# Altium project Sophia_Lake.PrjPcb (part 3 of 4)

## Sheet DDR.SchDoc
size C; DocumentNumber: 5; SheetNumber: 5; SheetTotal: 8
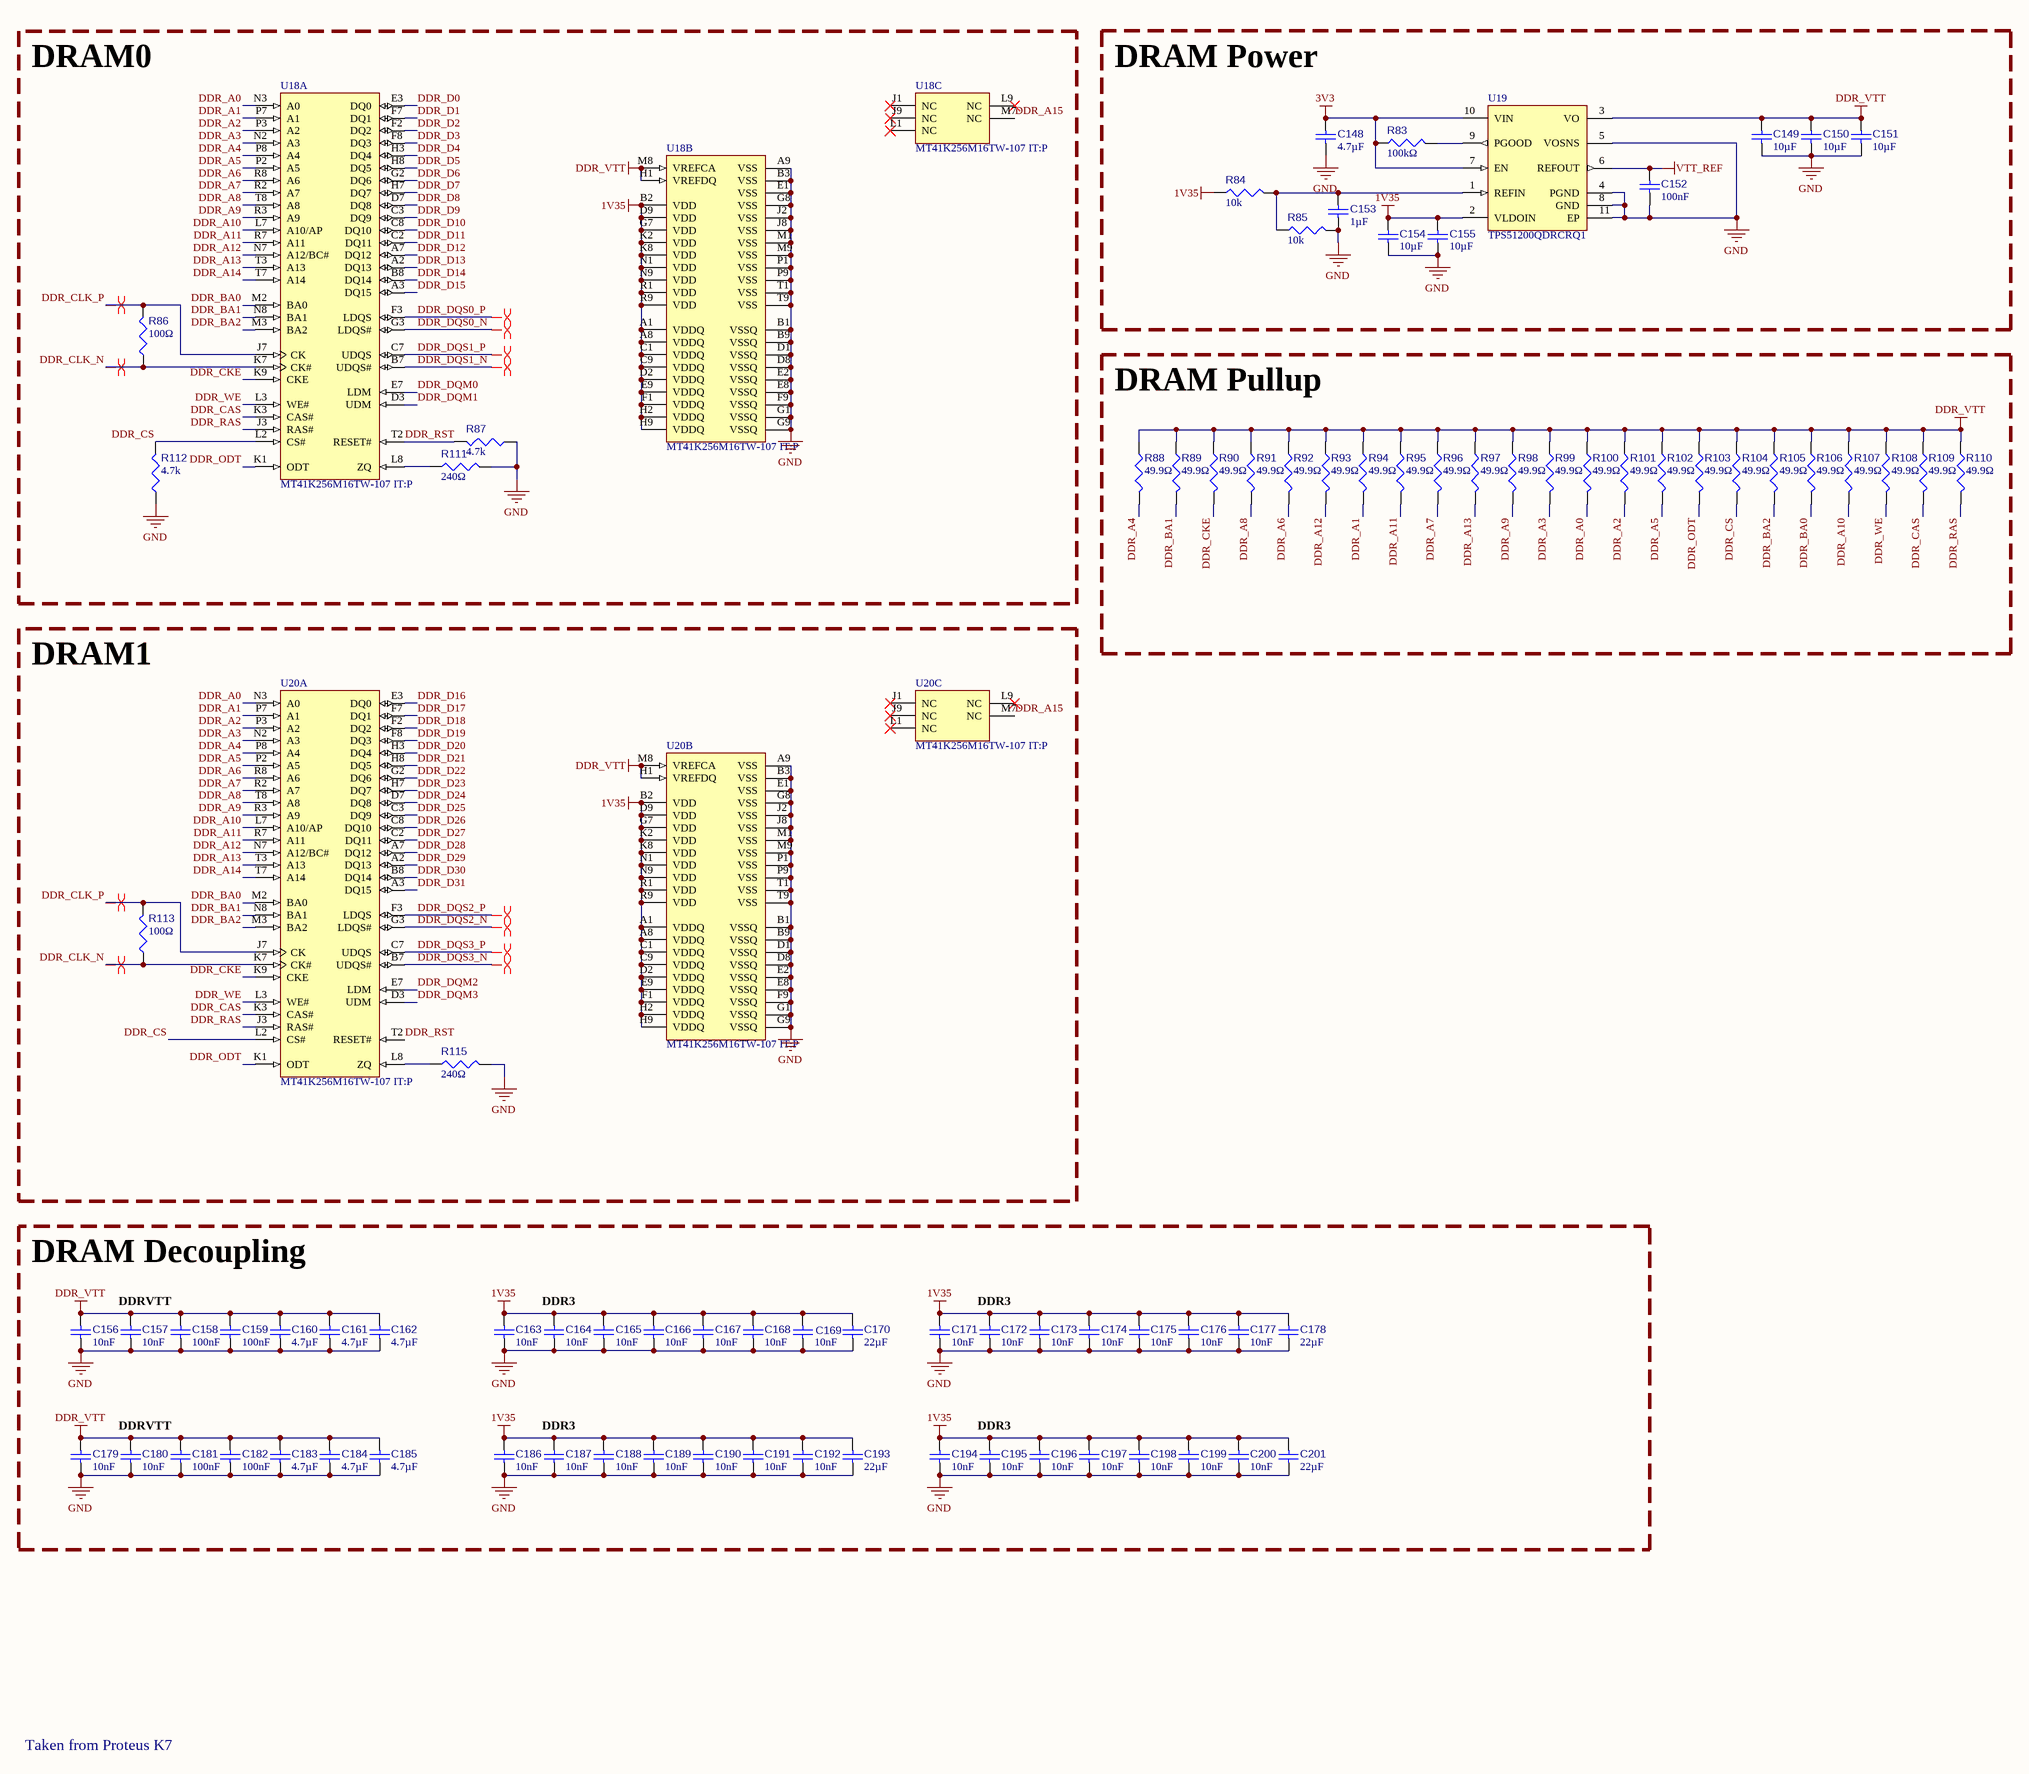
[diagram p8: DDR.SchDoc]

### Parts
C148  value 4.7µF  [CAP-0402-MFG]  (hidden comment: GRM155R61E475ME15D)
C149  value 10µF  [CAP-0603-MFG]  (hidden comment: GRT188R61C106KE13J)
C150  value 10µF  [CAP-0603-MFG]  (hidden comment: GRT188R61C106KE13J)
C151  value 10µF  [CAP-0603-MFG]  (hidden comment: GRT188R61C106KE13J)
C152  value 100nF  [CAP-0402-MFG]  (hidden comment: CL05B104KO5VPNC)
C153  value 1µF  [CAP-0402-MFG]  (hidden comment: GRT155C81C105KE13J)
C154  value 10µF  [CAP-0603-MFG]  (hidden comment: GRT188R61C106KE13J)
C155  value 10µF  [CAP-0603-MFG]  (hidden comment: GRT188R61C106KE13J)
C156  value 10nF  [CAP-0402-MFG]  (hidden comment: AC0402KRX7R7BB103)
C157  value 10nF  [CAP-0402-MFG]  (hidden comment: AC0402KRX7R7BB103)
C158  value 100nF  [CAP-0402-MFG]  (hidden comment: CL05B104KO5VPNC)
C159  value 100nF  [CAP-0402-MFG]  (hidden comment: CL05B104KO5VPNC)
C160  value 4.7µF  [CAP-0402-MFG]  (hidden comment: GRM155R61E475ME15D)
C161  value 4.7µF  [CAP-0402-MFG]  (hidden comment: GRM155R61E475ME15D)
C162  value 4.7µF  [CAP-0402-MFG]  (hidden comment: GRM155R61E475ME15D)
C163  value 10nF  [CAP-0402-MFG]  (hidden comment: AC0402KRX7R7BB103)
C164  value 10nF  [CAP-0402-MFG]  (hidden comment: AC0402KRX7R7BB103)
C165  value 10nF  [CAP-0402-MFG]  (hidden comment: AC0402KRX7R7BB103)
C166  value 10nF  [CAP-0402-MFG]  (hidden comment: AC0402KRX7R7BB103)
C167  value 10nF  [CAP-0402-MFG]  (hidden comment: AC0402KRX7R7BB103)
C168  value 10nF  [CAP-0402-MFG]  (hidden comment: AC0402KRX7R7BB103)
C169  value 10nF  [CAP-0402-MFG]  (hidden comment: AC0402KRX7R7BB103)
C170  value 22µF  [CAP-0402-MFG]  (hidden comment: GRM158R61A226ME15D)
C171  value 10nF  [CAP-0402-MFG]  (hidden comment: AC0402KRX7R7BB103)
C172  value 10nF  [CAP-0402-MFG]  (hidden comment: AC0402KRX7R7BB103)
C173  value 10nF  [CAP-0402-MFG]  (hidden comment: AC0402KRX7R7BB103)
C174  value 10nF  [CAP-0402-MFG]  (hidden comment: AC0402KRX7R7BB103)
C175  value 10nF  [CAP-0402-MFG]  (hidden comment: AC0402KRX7R7BB103)
C176  value 10nF  [CAP-0402-MFG]  (hidden comment: AC0402KRX7R7BB103)
C177  value 10nF  [CAP-0402-MFG]  (hidden comment: AC0402KRX7R7BB103)
C178  value 22µF  [CAP-0402-MFG]  (hidden comment: GRM158R61A226ME15D)
C179  value 10nF  [CAP-0402-MFG]  (hidden comment: AC0402KRX7R7BB103)
C180  value 10nF  [CAP-0402-MFG]  (hidden comment: AC0402KRX7R7BB103)
C181  value 100nF  [CAP-0402-MFG]  (hidden comment: CL05B104KO5VPNC)
C182  value 100nF  [CAP-0402-MFG]  (hidden comment: CL05B104KO5VPNC)
C183  value 4.7µF  [CAP-0402-MFG]  (hidden comment: GRM155R61E475ME15D)
C184  value 4.7µF  [CAP-0402-MFG]  (hidden comment: GRM155R61E475ME15D)
C185  value 4.7µF  [CAP-0402-MFG]  (hidden comment: GRM155R61E475ME15D)
C186  value 10nF  [CAP-0402-MFG]  (hidden comment: AC0402KRX7R7BB103)
C187  value 10nF  [CAP-0402-MFG]  (hidden comment: AC0402KRX7R7BB103)
C188  value 10nF  [CAP-0402-MFG]  (hidden comment: AC0402KRX7R7BB103)
C189  value 10nF  [CAP-0402-MFG]  (hidden comment: AC0402KRX7R7BB103)
C190  value 10nF  [CAP-0402-MFG]  (hidden comment: AC0402KRX7R7BB103)
C191  value 10nF  [CAP-0402-MFG]  (hidden comment: AC0402KRX7R7BB103)
C192  value 10nF  [CAP-0402-MFG]  (hidden comment: AC0402KRX7R7BB103)
C193  value 22µF  [CAP-0402-MFG]  (hidden comment: GRM158R61A226ME15D)
C194  value 10nF  [CAP-0402-MFG]  (hidden comment: AC0402KRX7R7BB103)
C195  value 10nF  [CAP-0402-MFG]  (hidden comment: AC0402KRX7R7BB103)
C196  value 10nF  [CAP-0402-MFG]  (hidden comment: AC0402KRX7R7BB103)
C197  value 10nF  [CAP-0402-MFG]  (hidden comment: AC0402KRX7R7BB103)
C198  value 10nF  [CAP-0402-MFG]  (hidden comment: AC0402KRX7R7BB103)
C199  value 10nF  [CAP-0402-MFG]  (hidden comment: AC0402KRX7R7BB103)
C200  value 10nF  [CAP-0402-MFG]  (hidden comment: AC0402KRX7R7BB103)
C201  value 22µF  [CAP-0402-MFG]  (hidden comment: GRM158R61A226ME15D)
R83  value 100kΩ  [RES-0402]  (hidden comment: AC0402FR-07100KL)
R84  value 10k  [RES-0402]  (hidden comment: AC0402FR-0710KL)
R85  value 10k  [RES-0402]  (hidden comment: AC0402FR-0710KL)
R86  value 100Ω  [RES-0402]  (hidden comment: AC0402FR-07100RL)
R87  value 4.7k  [RES-0402]  (hidden comment: AC0402FR-074K7L)
R88  value 49.9Ω  [RES-0402]  (hidden comment: CRCW040249R9FKED)
R89  value 49.9Ω  [RES-0402]  (hidden comment: CRCW040249R9FKED)
R90  value 49.9Ω  [RES-0402]  (hidden comment: CRCW040249R9FKED)
R91  value 49.9Ω  [RES-0402]  (hidden comment: CRCW040249R9FKED)
R92  value 49.9Ω  [RES-0402]  (hidden comment: CRCW040249R9FKED)
R93  value 49.9Ω  [RES-0402]  (hidden comment: CRCW040249R9FKED)
R94  value 49.9Ω  [RES-0402]  (hidden comment: CRCW040249R9FKED)
R95  value 49.9Ω  [RES-0402]  (hidden comment: CRCW040249R9FKED)
R96  value 49.9Ω  [RES-0402]  (hidden comment: CRCW040249R9FKED)
R97  value 49.9Ω  [RES-0402]  (hidden comment: CRCW040249R9FKED)
R98  value 49.9Ω  [RES-0402]  (hidden comment: CRCW040249R9FKED)
R99  value 49.9Ω  [RES-0402]  (hidden comment: CRCW040249R9FKED)
R100  value 49.9Ω  [RES-0402]  (hidden comment: CRCW040249R9FKED)
R101  value 49.9Ω  [RES-0402]  (hidden comment: CRCW040249R9FKED)
R102  value 49.9Ω  [RES-0402]  (hidden comment: CRCW040249R9FKED)
R103  value 49.9Ω  [RES-0402]  (hidden comment: CRCW040249R9FKED)
R104  value 49.9Ω  [RES-0402]  (hidden comment: CRCW040249R9FKED)
R105  value 49.9Ω  [RES-0402]  (hidden comment: CRCW040249R9FKED)
R106  value 49.9Ω  [RES-0402]  (hidden comment: CRCW040249R9FKED)
R107  value 49.9Ω  [RES-0402]  (hidden comment: CRCW040249R9FKED)
R108  value 49.9Ω  [RES-0402]  (hidden comment: CRCW040249R9FKED)
R109  value 49.9Ω  [RES-0402]  (hidden comment: CRCW040249R9FKED)
R110  value 49.9Ω  [RES-0402]  (hidden comment: CRCW040249R9FKED)
R111  value 240Ω  [RES-0402]  (hidden comment: AC0402FR-07240RL)
R112  value 4.7k  [RES-0402]  (hidden comment: AC0402FR-074K7L)
R113  value 100Ω  [RES-0402]  (hidden comment: AC0402FR-07100RL)
R115  value 240Ω  [RES-0402]  (hidden comment: AC0402FR-07240RL)
U18  MT41K256M16TW-107 IT:P  [MICT-TW-96]  (parts A,B,C of 3)
U19  TPS51200QDRCRQ1  [FP-DRC0010J-MFG]
U20  MT41K256M16TW-107 IT:P  [MICT-TW-96]  (parts A,B,C of 3)

### Blocks framed on the sheet
DRAM0: R86 R87 R111 R112 U18
DRAM Power: C148-C155 R83-R85 U19
DRAM Pullup: R88-R110
DRAM1: R113 R115 U20
DRAM Decoupling: C156-C201

### Nets
1V35: C154.1 C155.1 C163.1 C164.1 C165.1 C166.1 C167.1 C168.2 C169.1 C170.1 C171.1 C172.2 C173.2 C174.2 C175.2 C176.2 C177.2 C178.1 C186.1 C187.2 C188.2 C189.2 C190.2 C191.2 C192.2 C193.1 C194.1 C195.2 C196.2 C197.2 C198.2 C199.2 C200.2 C201.1 R84.1 U18.A1(VDDQ) U18.A8(VDDQ) U18.B2(VDD) U18.C1(VDDQ) U18.C9(VDDQ) U18.D2(VDDQ) U18.D9(VDD) U18.E9(VDDQ) U18.F1(VDDQ) U18.G7(VDD) U18.H2(VDDQ) U18.H9(VDDQ) U18.K2(VDD) U18.K8(VDD) U18.N1(VDD) U18.N9(VDD) U18.R1(VDD) U18.R9(VDD) U19.2(VLDOIN) U20.A1(VDDQ) U20.A8(VDDQ) U20.B2(VDD) U20.C1(VDDQ) U20.C9(VDDQ) U20.D2(VDDQ) U20.D9(VDD) U20.E9(VDDQ) U20.F1(VDDQ) U20.G7(VDD) U20.H2(VDDQ) U20.H9(VDDQ) U20.K2(VDD) U20.K8(VDD) U20.N1(VDD) U20.N9(VDD) U20.R1(VDD) U20.R9(VDD)
3V3: C148.1 R83.1 U19.7(EN) U19.10(VIN)
DDR_VTT: C149.1 C150.1 C151.2 C156.1 C157.1 C158.2 C159.2 C160.1 C161.1 C162.2 C179.1 C180.1 C181.1 C182.1 C183.1 C184.1 C185.2 R88.1 R89.1 R90.1 R91.1 R92.1 R93.1 R94.1 R95.1 R96.1 R97.1 R98.1 R99.1 R100.1 R101.1 R102.1 R103.1 R104.1 R105.1 R106.1 R107.1 R108.1 R109.1 R110.1 U18.H1(VREFDQ) U18.M8(VREFCA) U19.3(VO) U20.H1(VREFDQ) U20.M8(VREFCA)
GND: C148.2 C149.2 C150.2 C151.1 C152.2 C153.1 C154.2 C155.2 C156.2 C157.2 C158.1 C159.1 C160.2 C161.2 C162.1 C163.2 C164.2 C165.2 C166.2 C167.2 C168.1 C169.2 C170.2 C171.2 C172.1 C173.1 C174.1 C175.1 C176.1 C177.1 C178.2 C179.2 C180.2 C181.2 C182.2 C183.2 C184.2 C185.1 C186.2 C187.1 C188.1 C189.1 C190.1 C191.1 C192.1 C193.2 C194.2 C195.1 C196.1 C197.1 C198.1 C199.1 C200.1 C201.2 R85.2 R87.1 R111.2 R112.1 R115.2 U18.A9(VSS) U18.B1(VSSQ) U18.B3(VSS) U18.B9(VSSQ) U18.D1(VSSQ) U18.D8(VSSQ) U18.E1(VSS) U18.E2(VSSQ) U18.E8(VSSQ) U18.F9(VSSQ) U18.G1(VSSQ) U18.G8(VSS) U18.G9(VSSQ) U18.J2(VSS) U18.J8(VSS) U18.M1(VSS) U18.M9(VSS) U18.P1(VSS) U18.P9(VSS) U18.T1(VSS) U18.T9(VSS) U19.4(PGND) U19.5(VOSNS) U19.8(GND) U19.11(EP) U20.A9(VSS) U20.B1(VSSQ) U20.B3(VSS) U20.B9(VSSQ) U20.D1(VSSQ) U20.D8(VSSQ) U20.E1(VSS) U20.E2(VSSQ) U20.E8(VSSQ) U20.F9(VSSQ) U20.G1(VSSQ) U20.G8(VSS) U20.G9(VSSQ) U20.J2(VSS) U20.J8(VSS) U20.M1(VSS) U20.M9(VSS) U20.P1(VSS) U20.P9(VSS) U20.T1(VSS) U20.T9(VSS)
VTT_REF: C152.1 U19.6(REFOUT)
DDR_A0: R100.2 U18.N3(A0) U20.N3(A0)
DDR_A1: R94.2 U18.P7(A1) U20.P7(A1)
DDR_A2: R101.2 U18.P3(A2) U20.P3(A2)
DDR_A3: R99.2 U18.N2(A3) U20.N2(A3)
DDR_A4: R88.2 U18.P8(A4) U20.P8(A4)
DDR_A5: R102.2 U18.P2(A5) U20.P2(A5)
DDR_A6: R92.2 U18.R8(A6) U20.R8(A6)
DDR_A7: R96.2 U18.R2(A7) U20.R2(A7)
DDR_A8: R91.2 U18.T8(A8) U20.T8(A8)
DDR_A9: R98.2 U18.R3(A9) U20.R3(A9)
DDR_A10: R107.2 U18.L7(A10/AP) U20.L7(A10/AP)
DDR_A11: R95.2 U18.R7(A11) U20.R7(A11)
DDR_A12: R93.2 U18.N7(A12/BC#) U20.N7(A12/BC#)
DDR_A13: R97.2 U18.T3(A13) U20.T3(A13)
DDR_A14: U18.T7(A14) U20.T7(A14)
DDR_A15: U18.M7(NC) U20.M7(NC)
DDR_BA0: R106.2 U18.M2(BA0) U20.M2(BA0)
DDR_BA1: R89.2 U18.N8(BA1) U20.N8(BA1)
DDR_BA2: R105.2 U18.M3(BA2) U20.M3(BA2)
DDR_CAS: R109.2 U18.K3(CAS#) U20.K3(CAS#)
DDR_CKE: R90.2 U18.K9(CKE) U20.K9(CKE)
DDR_CLK_N: R86.1 R113.1 U18.K7(CK#) U20.K7(CK#)
DDR_CLK_P: R86.2 R113.2 U18.J7(CK) U20.J7(CK)
DDR_CS: R104.2 R112.2 U18.L2(CS#) U20.L2(CS#)
DDR_D0: U18.E3(DQ0)
DDR_D1: U18.F7(DQ1)
DDR_D2: U18.F2(DQ2)
DDR_D3: U18.F8(DQ3)
DDR_D4: U18.H3(DQ4)
DDR_D5: U18.H8(DQ5)
DDR_D6: U18.G2(DQ6)
DDR_D7: U18.H7(DQ7)
DDR_D8: U18.D7(DQ8)
DDR_D9: U18.C3(DQ9)
DDR_D10: U18.C8(DQ10)
DDR_D11: U18.C2(DQ11)
DDR_D12: U18.A7(DQ12)
DDR_D13: U18.A2(DQ13)
DDR_D14: U18.B8(DQ14)
DDR_D15: U18.A3(DQ15)
DDR_D16: U20.E3(DQ0)
DDR_D17: U20.F7(DQ1)
DDR_D18: U20.F2(DQ2)
DDR_D19: U20.F8(DQ3)
DDR_D20: U20.H3(DQ4)
DDR_D21: U20.H8(DQ5)
DDR_D22: U20.G2(DQ6)
DDR_D23: U20.H7(DQ7)
DDR_D24: U20.D7(DQ8)
DDR_D25: U20.C3(DQ9)
DDR_D26: U20.C8(DQ10)
DDR_D27: U20.C2(DQ11)
DDR_D28: U20.A7(DQ12)
DDR_D29: U20.A2(DQ13)
DDR_D30: U20.B8(DQ14)
DDR_D31: U20.A3(DQ15)
DDR_DQM0: U18.E7(LDM)
DDR_DQM1: U18.D3(UDM)
DDR_DQM2: U20.E7(LDM)
DDR_DQM3: U20.D3(UDM)
DDR_DQS0_N: U18.G3(LDQS#)
DDR_DQS0_P: U18.F3(LDQS)
DDR_DQS1_N: U18.B7(UDQS#)
DDR_DQS1_P: U18.C7(UDQS)
DDR_DQS2_N: U20.G3(LDQS#)
DDR_DQS2_P: U20.F3(LDQS)
DDR_DQS3_N: U20.B7(UDQS#)
DDR_DQS3_P: U20.C7(UDQS)
DDR_ODT: R103.2 U18.K1(ODT) U20.K1(ODT)
DDR_RAS: R110.2 U18.J3(RAS#) U20.J3(RAS#)
DDR_RST: R87.2 U18.T2(RESET#) U20.T2(RESET#)
DDR_WE: R108.2 U18.L3(WE#) U20.L3(WE#)
NetC153_2: C153.2 R84.2 R85.1 U19.1(REFIN)
NetR83_2: R83.2 U19.9(PGOOD)
NetR111_1: R111.1 U18.L8(ZQ)
NetR115_1: R115.1 U20.L8(ZQ)

Not connected (* = marked no-connect by the designer): U18 J1(NC)* J9(NC)* L1(NC)* L9(NC)*; U20 J1(NC)* J9(NC)* L1(NC)* L9(NC)*

### Layout directives
differential pair: DDR_CLK_N, DDR_CLK_P, DDR_DQS0_N, DDR_DQS1_N, DDR_DQS1_P, DDR_DQS2_N, DDR_DQS3_N, DDR_DQS3_P
differential pair; differential pair class DDR: DDR_DQS0_P, DDR_DQS2_P

### Notes on the sheet
- (near C157) DDRVTT
- (near C164) DDR3
- (near C172) DDR3
- (near C180) DDRVTT
- (near C187) DDR3
- (near C195) DDR3
- Taken from Proteus K7

### Library data of the parts
C148 C160-C162 C183-C185 = CMP-104-000119-5: as C56 on sheet FPGA; Pin Count: 2; Case/Package: 0402; Mounting Technology: Surface Mount; Source: Components - 11.02.26 - 17.26.SchLib; JLC PN: C2858031; Min Operating Temperature: -55°C; Max Operating Temperature: 85°C; Design Item ID: CMP-001-00116-4; Component Type: Standard; Info: 0402-4.7u-20%-25V-X5R; Pins: 2; Manufacturer Part Number: GRM155R61E475ME15D
C149-C151 C154 C155 = CMP-104-000103-5: as C137 on sheet FPGA; Design Item ID: CMP-001-00130-1; Min Operating Temperature: -55°C; Source: Components - 11.02.26 - 17.26.SchLib; Info: 0603-10u-10%-16V-X5R-AECQ200; Mounting Technology: Surface Mount; Pin Count: 2; Pins: 2; Manufacturer Part Number: GRT188R61C106KE13J; Max Operating Temperature: 85°C; Component Type: Standard; Case/Package: 0603; JLC PN: C3888097
C152 C158 C159 C181 C182 = CMP-104-000086-6: as C130-C136 on sheet FPGA; Component Type: Standard; Min Operating Temperature: -55°C; Source: Components - 11.02.26 - 17.26.SchLib; Design Item ID: CMP-001-00111-7; Pin Count: 2; Max Operating Temperature: 125°C; Case/Package: 0402; Pins: 2; Info: 0402-100n-10%-16V-X7R-AECQ200; Manufacturer Part Number: CL05B104KO5VPNC; Mounting Technology: Surface Mount; JLC PN: C307332
C153 = CMP-104-000087-6: as C146 on sheet FPGA; Min Operating Temperature: -55°C; Pin Count: 2; Design Item ID: CMP-001-00112-5; Manufacturer Part Number: GRT155C81C105KE13J; Info: 0402-1u-10%-16V-X6S-AECQ200; Mounting Technology: Surface Mount; Component Type: Standard; Case/Package: 0402; Source: Components - 11.02.26 - 17.26.SchLib; Max Operating Temperature: 105°C; Pins: 2; JLC PN: C908010
C156 C157 C163-C169 C171-C177 C179 C180 C186-C192 C194-C200 = CMP-104-000090-6: 0402-10n-10%-16V-X7R-AECQ200; Manufacturer Name: YAGEO; Capacitor Type: Ceramic; Temp Code: X7R; Tolerance: 10%; Voltage Rating: 16V; Design Item ID: CMP-001-00115-5; Mounting Technology: Surface Mount; Case/Package: 0402; Pins: 2; Manufacturer Part Number: AC0402KRX7R7BB103; Min Operating Temperature: -55°C; Info: 0402-10n-10%-16V-X7R-AECQ200; Pin Count: 2; Max Operating Temperature: 125°C; Component Type: Standard; Source: Components - 11.02.26 - 17.26.SchLib; JLC PN: C726515
C170 C178 C193 C201 = CMP-104-000116-5: 0402-22u-20%-10V-X5R; Manufacturer Name: Murata; Capacitor Type: Ceramic; Temp Code: X5R; Tolerance: 20%; Voltage Rating: 10V; Max Operating Temperature: 85°C; Source: Components - 11.02.26 - 17.26.SchLib; Mounting Technology: Surface Mount; Pins: 2; Design Item ID: CMP-001-00111-7; Case/Package: 0402; Info: 0402-22u-20%-10V-X5R; JLC PN: C3845593; Pin Count: 2; Min Operating Temperature: -55°C; Component Type: Standard; Manufacturer Part Number: GRM158R61A226ME15D
R83 = CMP-014-000103-4: 0402-100k-1%-1/16W-AEC-Q200; Manufacturer Name: YAGEO; Tolerance: 1%; Voltage Rating: 50V; Power: 63mW; Min Operating Temperature: -55°C; Pin Count: 2; Component Type: Standard; Manufacturer Part Number: AC0402FR-07100KL; Design Item ID: CMP-009-00205-1; Source: Components - 11.02.26 - 17.27.SchLib; Mounting Technology: Surface Mount; Case/Package: 0402; Pins: 2; Info: 0402-100k-1%-1/16W-AEC-Q200; Max Operating Temperature: 155°C; JLC PN: C144809
R84 R85 = CMP-014-000077-5: as R63 on sheet FPGA; Pins: 2; Source: Components - 11.02.26 - 17.27.SchLib; Manufacturer Part Number: AC0402FR-0710KL; Info: 0402-10k-1%-1/16W-AEC-Q200; Min Operating Temperature: -55°C; Pin Count: 2; Case/Package: 0402; Design Item ID: CMP-009-00191-3; Max Operating Temperature: 155°C; Component Type: Standard; Mounting Technology: Surface Mount; JLC PN: C144807
R86 R113 = CMP-014-000108-4: 0402-100-1%-1/16W-AEC-Q200; Manufacturer Name: YAGEO; Voltage Rating: 50V; Power: 63mW; Tolerance: 1%; Case/Package: 0402; Manufacturer Part Number: AC0402FR-07100RL; Mounting Technology: Surface Mount; Pin Count: 2; Component Type: Standard; Max Operating Temperature: 155°C; Pins: 2; Design Item ID: CMP-009-00202-1; Min Operating Temperature: -55°C; Source: Components - 11.02.26 - 17.27.SchLib; Info: 0402-100-1%-1/16W-AEC-Q200; JLC PN: C144808
R87 R112 = CMP-014-000082-5: 0402-4.7k-1%-1/16W-AEC-Q200; Manufacturer Name: YAGEO; Tolerance: 1%; Power: 63mW; Voltage Rating: 50V; Component Type: Standard; Source: Components - 11.02.26 - 17.27.SchLib; Min Operating Temperature: -55°C; Mounting Technology: Surface Mount; Design Item ID: CMP-009-00196-1; Manufacturer Part Number: AC0402FR-074K7L; Max Operating Temperature: 155°C; Pins: 2; Case/Package: 0402; Pin Count: 2; Info: 0402-4.7k-1%-1/16W-AEC-Q200; JLC PN: C174364
R88-R110 = CMP-014-000125-4: 0402-49.9-1%-1/16W-AEC-Q200; Manufacturer Name: Vishay; Tolerance: 1%; Voltage Rating: 50V; Power: 63mW; Manufacturer Part Number: CRCW040249R9FKED; Case/Package: 0402; Design Item ID: CMP-009-00210-1; Source: Components - 11.02.26 - 17.27.SchLib; Pins: 2; Max Operating Temperature: 155°C; Min Operating Temperature: -55°C; Info: 0402-49.9-1%-1/16W-AEC-Q200; Mounting Technology: Surface Mount; JLC PN: C482189
R111 R115 = CMP-014-000124-4: 0402-240-1%-1/16W-AEC-Q200; Manufacturer Name: YAGEO; Power: 63mW; Voltage Rating: 50V; Tolerance: 1%; Info: 0402-240-1%-1/16W-AEC-Q200; Pins: 2; Max Operating Temperature: 155°C; Manufacturer Part Number: AC0402FR-07240RL; Mounting Technology: Surface Mount; Source: Components - 11.02.26 - 17.27.SchLib; Min Operating Temperature: -55°C; Case/Package: 0402; Design Item ID: CMP-009-00199-1; JLC PN: C144776
U18 U20 = CMP-051-000051-2: IC DRAM 4GBIT PAR 96FBGA SDRAM - DDR3L Memory IC 4Gbit Parallel 933 MHz 20 ns 96-FBGA (8x14); Manufacturer Name: Micron; Data Bus Width: 16b; Address Bus Width: 15b; Operating Supply Voltage: 1.35V; Max Supply Voltage: 1.45V; Clock Frequency: 933MHz; Min Supply Voltage: 1.283V; Max Operating Temperature: 95°C; Min Operating Temperature: -40°C; Mounting Technology: Surface Mount; JLC PN: C367428; Pins: 96; Case/Package: BGA; Terminal Pitch: 800µm; Manufacturer Part Number: MT41K256M16TW-107 IT:P
U19 = CMP-051-000049-2: DDR/DDR2/DDR3/DDR3L/LPDDR3/DDR4 Termination Regulator 3A 2.375V to 3.5V 10-Pin VSON T/R; Manufacturer Name: Texas Instruments; Reference Voltage: 1.8V; Min Input Voltage: 2.3V; Nominal Output Voltage: 1.25V; Output Type: Fixed; Power Dissipation: 1.92W; Max Operating Temperature: 125°C; Min Supply Voltage: 2.375V; Output Current: 3A; Max Supply Voltage: 3.5V; Min Operating Temperature: -40°C; Pins: 10; JLC PN: C2991161; Manufacturer Part Number: TPS51200QDRCRQ1

## Sheet SoC.SchDoc
size C; DocumentNumber: 7; SheetNumber: 7; SheetTotal: 8
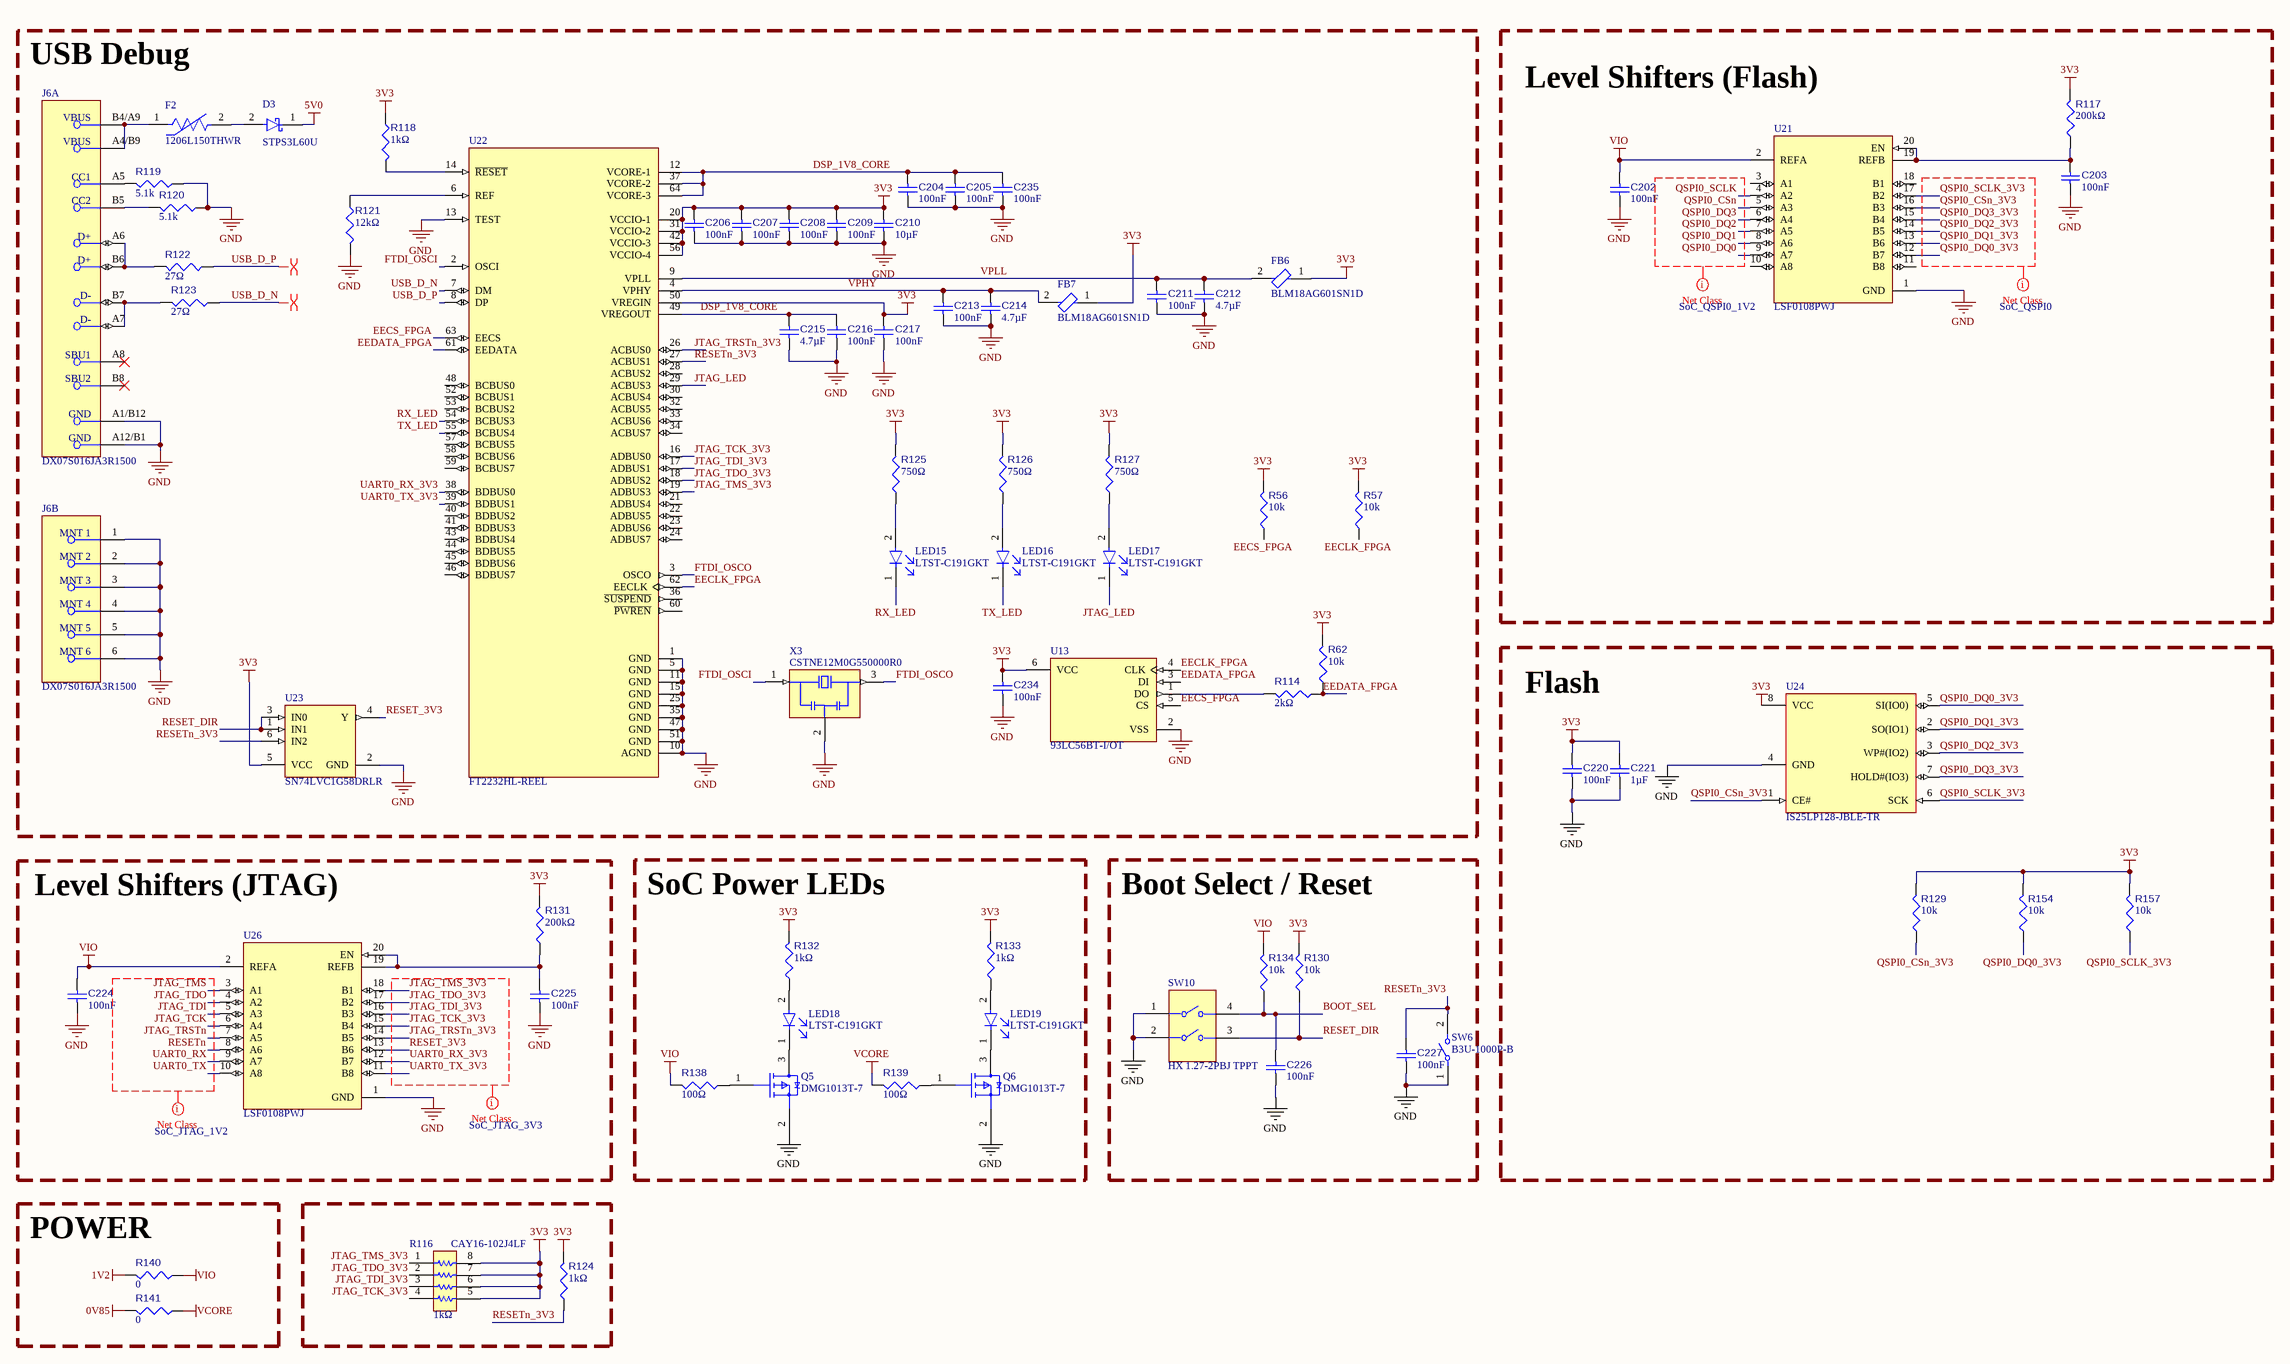
[diagram p9: SoC.SchDoc]

### Parts
C202  value 100nF  [CAP-0402-MFG]  (hidden comment: CL05B104KO5VPNC)
C203  value 100nF  [CAP-0402-MFG]  (hidden comment: CL05B104KO5VPNC)
C204  value 100nF  [CAP-0402-MFG]  (hidden comment: CL05B104KO5VPNC)
C205  value 100nF  [CAP-0402-MFG]  (hidden comment: CL05B104KO5VPNC)
C206  value 100nF  [CAP-0402-MFG]  (hidden comment: CL05B104KO5VPNC)
C207  value 100nF  [CAP-0402-MFG]  (hidden comment: CL05B104KO5VPNC)
C208  value 100nF  [CAP-0402-MFG]  (hidden comment: CL05B104KO5VPNC)
C209  value 100nF  [CAP-0402-MFG]  (hidden comment: CL05B104KO5VPNC)
C210  value 10µF  [CAP-0603-MFG]  (hidden comment: GRT188R61C106KE13J)
C211  value 100nF  [CAP-0402-MFG]  (hidden comment: CL05B104KO5VPNC)
C212  value 4.7µF  [CAP-0402-MFG]  (hidden comment: GRM155R61E475ME15D)
C213  value 100nF  [CAP-0402-MFG]  (hidden comment: CL05B104KO5VPNC)
C214  value 4.7µF  [CAP-0402-MFG]  (hidden comment: GRM155R61E475ME15D)
C215  value 4.7µF  [CAP-0402-MFG]  (hidden comment: GRM155R61E475ME15D)
C216  value 100nF  [CAP-0402-MFG]  (hidden comment: CL05B104KO5VPNC)
C217  value 100nF  [CAP-0402-MFG]  (hidden comment: CL05B104KO5VPNC)
C220  value 100nF  [CAP-0402-MFG]  (hidden comment: CL05B104KO5VPNC)
C221  value 1µF  [CAP-0402-MFG]  (hidden comment: GRT155C81C105KE13J)
C224  value 100nF  [CAP-0402-MFG]  (hidden comment: CL05B104KO5VPNC)
C225  value 100nF  [CAP-0402-MFG]  (hidden comment: CL05B104KO5VPNC)
C226  value 100nF  [CAP-0402-MFG]  (hidden comment: CL05B104KO5VPNC)
C227  value 100nF  [CAP-0402-MFG]  (hidden comment: CL05B104KO5VPNC)
C234  value 100nF  [CAP-0402-MFG]  (hidden comment: CL05B104KO5VPNC)
C235  value 100nF  [CAP-0402-MFG]  (hidden comment: CL05B104KO5VPNC)
D3  STPS3L60U  [FP-DO214AA-MFG]
F2  1206L150THWR  [FP-1206L050YR-MFG]
FB6  BLM18AG601SN1D  [FERRITEBEAD-0603-MFG]
FB7  BLM18AG601SN1D  [FERRITEBEAD-0603-MFG]
J6  DX07S016JA3R1500  [FP-DX07S016JA3R1500-MFG]  (parts A,B of 2)
LED15  LTST-C191GKT  [LED-0603-MFG]
LED16  LTST-C191GKT  [LED-0603-MFG]
LED17  LTST-C191GKT  [LED-0603-MFG]
LED18  LTST-C191GKT  [LED-0603-MFG]
LED19  LTST-C191GKT  [LED-0603-MFG]
Q5  DMG1013T-7  [FP-SOT523-MFG]
Q6  DMG1013T-7  [FP-SOT523-MFG]
R56  value 10k  [RES-0402]  (hidden comment: AC0402FR-0710KL)
R57  value 10k  [RES-0402]  (hidden comment: AC0402FR-0710KL)
R62  value 10k  [RES-0402]  (hidden comment: AC0402FR-0710KL)
R114  value 2kΩ  [RES-0402]  (hidden comment: AC0402FR-072KL)
R116  CAY16-102J4LF  value 1kΩ  [RES-4x0603-MFG]
R117  value 200kΩ  [RES-0402]  (hidden comment: AC0402FR-07200KL)
R118  value 1kΩ  [RES-0402]  (hidden comment: AC0402FR-071KL)
R119  value 5.1k  [RES-0402]  (hidden comment: AC0402FR-075K1L)
R120  value 5.1k  [RES-0402]  (hidden comment: AC0402FR-075K1L)
R121  value 12kΩ  [RES-0402]  (hidden comment: AC0402FR-0712KL)
R122  value 27Ω  [RES-0402]  (hidden comment: AC0402FR-0727RL)
R123  value 27Ω  [RES-0402]  (hidden comment: AC0402FR-0727RL)
R124  value 1kΩ  [RES-0402]  (hidden comment: AC0402FR-071KL)
R125  value 750Ω  [RES-0402]  (hidden comment: AC0402FR-07750RL)
R126  value 750Ω  [RES-0402]  (hidden comment: AC0402FR-07750RL)
R127  value 750Ω  [RES-0402]  (hidden comment: AC0402FR-07750RL)
R129  value 10k  [RES-0402]  (hidden comment: AC0402FR-0710KL)
R130  value 10k  [RES-0402]  (hidden comment: AC0402FR-0710KL)
R131  value 200kΩ  [RES-0402]  (hidden comment: AC0402FR-07200KL)
R132  value 1kΩ  [RES-0402]  (hidden comment: AC0402FR-071KL)
R133  value 1kΩ  [RES-0402]  (hidden comment: AC0402FR-071KL)
R134  value 10k  [RES-0402]  (hidden comment: AC0402FR-0710KL)
R138  value 100Ω  [RES-0402]  (hidden comment: AC0402FR-07100RL)
R139  value 100Ω  [RES-0402]  (hidden comment: AC0402FR-07100RL)
R140  value 0  [RES-0603-MFG]  (hidden comment: AC0603FR-070RL)
R141  value 0  [RES-0603-MFG]  (hidden comment: AC0603FR-070RL)
R154  value 10k  [RES-0402]  (hidden comment: AC0402FR-0710KL)
R157  value 10k  [RES-0402]  (hidden comment: AC0402FR-0710KL)
SW6  B3U-1000P-B  [FP-B3U-1000P-B-MFG]
SW10  HX 1.27-2PBJ TPPT  [HX 1.27-2PBJ TPPT-Footprint-1]
U13  93LC56BT-I/OT  [FP-SOT-23-6-MFG]
U21  LSF0108PWJ  [FP-TSSOP20-MFG]
U22  FT2232HL-REEL  [LQFP-64-MFG]
U23  SN74LVC1G58DRLR  [DRL0006A_M]
U24  IS25LP128-JBLE-TR  [FP-SOIC8-MFG]
U26  LSF0108PWJ  [FP-TSSOP20-MFG]
X3  CSTNE12M0G550000R0  [OSC-SMD3213-3P]

### Blocks framed on the sheet
USB Debug: C204-C217 C234 C235 D3 F2 FB6 FB7 J6 LED15-LED17 R56 R57 R62 R114 R118-R123 R125-R127 U13 U22 U23 X3
Level Shifters (Flash): C202 C203 R117 U21
Flash: C220 C221 R129 R154 R157 U24
Level Shifters (JTAG): C224 C225 R131 U26
SoC Power LEDs: LED18 LED19 Q5 Q6 R132 R133 R138 R139
Boot Select / Reset: C226 C227 R130 R134 SW6 SW10
POWER: R140 R141

### Nets
0V85: R141.2
1V2: R140.2
3V3: C206.1 C207.2 C208.1 C209.1 C210.1 C217.1 C220.1 C221.1 C234.2 FB6.1 FB7.1 R56.2 R57.2 R62.2 R116.5 R116.6 R116.7 R116.8 R117.2 R118.1 R124.2 R125.2 R126.2 R127.2 R129.2 R130.2 R131.2 R132.2 R133.2 R154.2 R157.2 U13.6(VCC) U22.20(VCCIO-1) U22.31(VCCIO-2) U22.42(VCCIO-3) U22.50(VREGIN) U22.56(VCCIO-4) U23.5(VCC) U24.8(VCC)
5V0: D3.1(K)
GND: C202.2 C203.2 C204.2 C205.2 C206.2 C207.1 C208.2 C209.2 C210.2 C211.2 C212.2 C213.2 C214.2 C215.2 C216.2 C217.2 C220.2 C221.2 C224.2 C225.2 C226.2 C227.2 C234.1 C235.2 J6.1(MNT_1) J6.2(MNT_2) J6.3(MNT_3) J6.4(MNT_4) J6.5(MNT_5) J6.6(MNT_6) J6.A1/B12(GND) J6.A12/B1(GND) Q5.2(S) Q6.2(S) R119.1 R120.1 R121.2 SW6.1 SW10.1 SW10.2 U13.2(VSS) U21.1(GND) U22.1(GND) U22.5(GND) U22.10(AGND) U22.11(GND) U22.13(TEST) U22.15(GND) U22.25(GND) U22.35(GND) U22.47(GND) U22.51(GND) U23.2(GND) U24.4(GND) U26.1(GND) X3.2(GND)
VCORE: R139.2 R141.1
VIO: C202.1 C224.1 R134.2 R138.2 R140.1 U21.2(REFA) U26.2(REFA)
BOOT_SEL: C226.1 R134.1 SW10.4
DSP_1V8_CORE: C204.1 C205.1 C215.1 C216.1 C235.1 U22.12(VCORE-1) U22.37(VCORE-2) U22.49(VREGOUT) U22.64(VCORE-3)
EECLK_FPGA: R57.1 U13.4(CLK) U22.62(EECLK)
EECS_FPGA: R56.1 U13.5(CS) U22.63(EECS)
EEDATA_FPGA: R62.1 R114.1 U13.3(DI) U22.61(EEDATA)
FTDI_OSCI: U22.2(OSCI) X3.1(IN)
FTDI_OSCO: U22.3(OSCO) X3.3(OUT)
JTAG_LED: LED17.1(C) U22.29(ACBUS3)
JTAG_TCK: U26.6(A4)
JTAG_TCK_3V3: R116.4 U22.16(ADBUS0) U26.15(B4)
JTAG_TDI: U26.5(A3)
JTAG_TDI_3V3: R116.3 U22.17(ADBUS1) U26.16(B3)
JTAG_TDO: U26.4(A2)
JTAG_TDO_3V3: R116.2 U22.18(ADBUS2) U26.17(B2)
JTAG_TMS: U26.3(A1)
JTAG_TMS_3V3: R116.1 U22.19(ADBUS3) U26.18(B1)
JTAG_TRSTn: U26.7(A5)
JTAG_TRSTn_3V3: U22.26(ACBUS0) U26.14(B5)
QSPI0_CSn: U21.5(A3)
QSPI0_CSn_3V3: R129.1 U21.16(B3) U24.1(CE#)
QSPI0_DQ0: U21.9(A7)
QSPI0_DQ0_3V3: R154.1 U21.12(B7) U24.5(SI(IO0))
QSPI0_DQ1: U21.8(A6)
QSPI0_DQ1_3V3: U21.13(B6) U24.2(SO(IO1))
QSPI0_DQ2: U21.7(A5)
QSPI0_DQ2_3V3: U21.14(B5) U24.3(WP#(IO2))
QSPI0_DQ3: U21.6(A4)
QSPI0_DQ3_3V3: U21.15(B4) U24.7(HOLD#(IO3))
QSPI0_SCLK: U21.4(A2)
QSPI0_SCLK_3V3: R157.1 U21.17(B2) U24.6(SCK)
RESET_3V3: U23.4(Y) U26.13(B6)
RESET_DIR: R130.1 SW10.3 U23.1(IN1) U23.3(IN0)
RESETn: U26.8(A6)
RESETn_3V3: C227.1 R124.1 SW6.2 U22.27(ACBUS1) U23.6(IN2)
RX_LED: LED15.1(C) U22.54(BCBUS3)
TX_LED: LED16.1(C) U22.55(BCBUS4)
UART0_RX: U26.9(A7)
UART0_RX_3V3: U22.38(BDBUS0) U26.12(B7)
UART0_TX: U26.10(A8)
UART0_TX_3V3: U22.39(BDBUS1) U26.11(B8)
USB_D_N: R123.1 U22.7(DM)
USB_D_P: R122.1 U22.8(DP)
VPHY: C213.1 C214.1 FB7.2 U22.4(VPHY)
VPLL: C211.1 C212.1 FB6.2 U22.9(VPLL)
NetC203_1: C203.1 R117.1 U21.19(REFB) U21.20(EN)
NetC225_1: C225.1 R131.1 U26.19(REFB) U26.20(EN)
NetD3_2: D3.2(A) F2.2
NetF2_1: F2.1 J6.A4/B9(VBUS) J6.B4/A9(VBUS)
NetJ6_A5: J6.A5(CC1) R119.2
NetJ6_A6: J6.A6(D+) J6.B6(D+) R122.2
NetJ6_A7: J6.A7(D-) J6.B7(D-) R123.2
NetJ6_B5: J6.B5(CC2) R120.2
NetLED15_2: LED15.2(A) R125.1
NetLED16_2: LED16.2(A) R126.1
NetLED17_2: LED17.2(A) R127.1
NetLED18_1: LED18.1(C) Q5.3(D)
NetLED18_2: LED18.2(A) R132.1
NetLED19_1: LED19.1(C) Q6.3(D)
NetLED19_2: LED19.2(A) R133.1
NetQ5_1: Q5.1(G) R138.1
NetQ6_1: Q6.1(G) R139.1
NetR114_2: R114.2 U13.1(DO)
NetR118_2: R118.2 U22.14(~{RESET})
NetR121_1: R121.1 U22.6(REF)

Not connected (* = marked no-connect by the designer): J6 A8(SBU1)* B8(SBU2)*; U21 3(A1) 10(A8) 11(B8) 18(B1); U22 21(ADBUS4) 22(ADBUS5) 23(ADBUS6) 24(ADBUS7) 28(ACBUS2) 30(ACBUS4) 32(ACBUS5) 33(ACBUS6) 34(ACBUS7) 36(~{SUSPEND}) 40(BDBUS2) 41(BDBUS3) 43(BDBUS4) 44(BDBUS5) 45(BDBUS6) 46(BDBUS7) 48(BCBUS0) 52(BCBUS1) 53(BCBUS2) 57(BCBUS5) 58(BCBUS6) 59(BCBUS7) 60(~{PWREN})

### Layout directives
differential pair: USB_D_N, USB_D_P
net class SoC_QSPI0: QSPI0_CSn_3V3, QSPI0_DQ0_3V3, QSPI0_DQ1_3V3, QSPI0_DQ2_3V3, QSPI0_DQ3_3V3, QSPI0_SCLK_3V3
net class SoC_QSPI0_1V2: QSPI0_CSn, QSPI0_DQ0, QSPI0_DQ1, QSPI0_DQ2, QSPI0_DQ3, QSPI0_SCLK
net class SoC_JTAG_3V3: JTAG_TCK_3V3, JTAG_TDI_3V3, JTAG_TDO_3V3, JTAG_TMS_3V3, JTAG_TRSTn_3V3, RESET_3V3, UART0_RX_3V3, UART0_TX_3V3
net class SoC_JTAG_1V2: JTAG_TCK, JTAG_TDI, JTAG_TDO, JTAG_TMS, JTAG_TRSTn, RESETn, UART0_RX, UART0_TX

### Library data of the parts
C202-C209 C211 C213 C216 C217 C220 C224-C227 C234 C235 = CMP-104-000086-6: 0402-100n-10%-16V-X7R-AECQ200; Manufacturer Name: Murata; Capacitor Type: Ceramic; Voltage Rating: 16V; Tolerance: 10%; Temp Code: X7R; Component Type: Standard; Min Operating Temperature: -55°C; Source: Components - 11.02.26 - 17.26.SchLib; Design Item ID: CMP-001-00111-7; Pin Count: 2; Max Operating Temperature: 125°C; Case/Package: 0402; Pins: 2; Info: 0402-100n-10%-16V-X7R-AECQ200; Manufacturer Part Number: CL05B104KO5VPNC; Mounting Technology: Surface Mount; JLC PN: C307332
C210 = CMP-104-000103-5: 0603-10u-10%-16V-X5R-AECQ200; Manufacturer Name: Murata; Tolerance: 10%; Voltage Rating: 16V; Capacitor Type: Ceramic; Design Item ID: CMP-001-00130-1; Min Operating Temperature: -55°C; Source: Components - 11.02.26 - 17.26.SchLib; Info: 0603-10u-10%-16V-X5R-AECQ200; Mounting Technology: Surface Mount; Pin Count: 2; Pins: 2; Manufacturer Part Number: GRT188R61C106KE13J; Max Operating Temperature: 85°C; Component Type: Standard; Case/Package: 0603; JLC PN: C3888097
C212 C214 C215 = CMP-104-000119-5: 0402-4.7u-20%-25V-X5R; Manufacturer Name: Murata; Temp Code: X5R; Tolerance: 20%; Capacitor Type: Ceramic; Voltage Rating: 25V; Pin Count: 2; Case/Package: 0402; Mounting Technology: Surface Mount; Source: Components - 11.02.26 - 17.26.SchLib; JLC PN: C2858031; Min Operating Temperature: -55°C; Max Operating Temperature: 85°C; Design Item ID: CMP-001-00116-4; Component Type: Standard; Info: 0402-4.7u-20%-25V-X5R; Pins: 2; Manufacturer Part Number: GRM155R61E475ME15D
C221 = CMP-104-000087-6: 0402-1u-10%-16V-X6S-AECQ200; Manufacturer Name: Murata; Temp Code: X6S; Voltage Rating: 16V; Capacitor Type: Ceramic; Tolerance: 10%; Min Operating Temperature: -55°C; Pin Count: 2; Design Item ID: CMP-001-00112-5; Manufacturer Part Number: GRT155C81C105KE13J; Info: 0402-1u-10%-16V-X6S-AECQ200; Mounting Technology: Surface Mount; Component Type: Standard; Case/Package: 0402; Source: Components - 11.02.26 - 17.26.SchLib; Max Operating Temperature: 105°C; Pins: 2; JLC PN: C908010
D3 = CMP-090-000051-3: DO214AA-UNI-SCHOTTKY-60V-3A-590mV; Manufacturer Name: STMicroelectronics; Forward Current: 3A; Max Reverse Leakage Current: 150µA; Forward Voltage: 590mV; Reverse Standoff Voltage: 60V; Min Operating Temperature: -65°C; Max Operating Temperature: 150°C; Info: DO214AA-UNI-SCHOTTKY-60V-3A-590mV; JLC PN: C132769; Case/Package: DO-214AA, SMB; Mounting Technology: Surface Mount; Manufacturer Part Number: STPS3L60U
F2 = CMP-008-000013-1: PTC Resettable Fuse 1.5A(hold) 3A(trip) 8VDC 100A 0.8W 0.3s 0.04Ohm SMD Solder Pad 1206 T/R; Manufacturer Name: Littelfuse; Power Dissipation: 800mW; Voltage Rating (DC): 8V; Time to Trip: 300ms; Approvals: TUV, cULus; Minimum Resistance Initial (Rmin): 40mΩ; Max Power Dissipation: 600mW; Value: 40mΩ; Maximum Resistance 1 Hour (R1max): 120mΩ; Max Operating Temperature: 85°C; Working Voltage: 8V; Number of Terminals: 2; Packaging: Cut Tape; Lifecycle Status: Production; Min Operating Temperature: -40°C; Height: 1mm; Hold Current: 1.5A; Operating Supply Voltage: 8V; Trip Current: 3A; Max Voltage Rating (DC): 8V; JLC PN: C118413; Current Rating: 100A; Width: 1.8mm; Case/Package: 1206; RoHS: Compliant; Voltage Rating: 8V; China RoHS: Compliant; Termination: SMD/SMT; Mounting Technology: Surface Mount; Case Code (Metric): 3216; Case Code (Imperial): 1206; Terminal Material: Copper; Lead Free: Lead Free; Manufacturer Part Number: 1206L150THWR; Ambient Temperature Range High: 85°C; REACH SVHC: Yes; Max Current Rating: 100A
FB6 FB7 = CMP-009-000012-2: Ferrite Beads Multi-Layer 600Ohm 25% 100MHz 500mA 380mOhm DCR 0603 Automotive Paper T/R; Manufacturer Name: Murata Electronics; Impedance: 600Ω; DC Resistance (DCR): 380mΩ; Frequency: 100MHz; JLC PN: C19330; Max Operating Temperature: 125°C; Current Rating: 500mA; Tolerance: 25%; Case/Package: 0603; Min Operating Temperature: -55°C; Manufacturer Part Number: BLM18AG601SN1D
J6 = CMP-055-000103-3: Receptacle, 16 Position, 1-Row SMT, without Rear Shield, Shell-DIP Length 1.2mm; Manufacturer Name: JAE Electronics; JLC PN: C3197625; Manufacturer Part Number: DX07S016JA3R1500
LED15-LED19 = CMP-132-000002-2: LED yellow green 0603 wavelength 569nm light intensity 12mcd Front Mounting; Manufacturer Name: Lite-On; Power Rating: 100mW; Viewing Angle: 130°; Forward Current: 30mA; Forward Voltage: 2.6V; Wavelength: 569nm; Pins: 2; Case/Package: 0603; Manufacturer Part Number: LTST-C191GKT; Min Operating Temperature: -55°C; Max Operating Temperature: 85°C; JLC PN: C99289; Mounting Technology: Surface Mount; Color: Green
Q5 Q6 = CMP-00055-3: P-Channel 20 V 0.7 Ohm 0.27 W Enhancement Mode Mosfet - SOT-523; Manufacturer Name: Diodes Inc; Power Dissipation: 270mW; Rds On Max: 700mΩ; Drain to Source Voltage (Vdss): -20V; Gate to Source Voltage (Vgs): 6V; Max Operating Temperature: 150°C; Min Operating Temperature: -55°C; Mounting Technology: Surface Mount; Max Power Dissipation: 270mW; Case/Package: SOT-523; Pins: 3; JLC PN: C96676; Manufacturer Part Number: DMG1013T-7
R56 R57 R62 R129 R130 R134 R154 R157 = CMP-014-000077-5: 0402-10k-1%-1/16W-AEC-Q200; Manufacturer Name: YAGEO; Tolerance: 1%; Voltage Rating: 50V; Power: 63mW; Pins: 2; Source: Components - 11.02.26 - 17.27.SchLib; Manufacturer Part Number: AC0402FR-0710KL; Info: 0402-10k-1%-1/16W-AEC-Q200; Min Operating Temperature: -55°C; Pin Count: 2; Case/Package: 0402; Design Item ID: CMP-009-00191-3; Max Operating Temperature: 155°C; Component Type: Standard; Mounting Technology: Surface Mount; JLC PN: C144807
R114 = CMP-014-000107-4: 0402-2k-1%-1/16W-AEC-Q200; Manufacturer Name: YAGEO; Voltage Rating: 50V; Tolerance: 1%; Power: 63mW; Max Operating Temperature: 155°C; Mounting Technology: Surface Mount; Case/Package: 0402; Component Type: Standard; Source: Components - 11.02.26 - 17.27.SchLib; Min Operating Temperature: -55°C; Info: 0402-2k-1%-1/16W-AEC-Q200; Design Item ID: CMP-009-00190-1; Pins: 2; Manufacturer Part Number: AC0402FR-072KL; Pin Count: 2; JLC PN: C144770
R116 = CMP-014-000102-1: Res Thick Film Array 1K Ohm 5% 0.25W(1/4W) ±200ppm/C ISOL 8-Pin 1206(4 X 0603) Convex SMD T/R; Manufacturer Name: Bourns; Number of Resistors: 4; Voltage Rating (DC): 50V; Power Dissipation: 250mW; Mounting Technology: Surface Mount; Tolerance: 5%; Manufacturer Part Number: CAY16-102J4LF; Min Operating Temperature: -55°C; JLC PN: C784824; Case/Package: 0603; Max Operating Temperature: 125°C; Pins: 8
R117 R131 = CMP-014-000126-4: 0402-200k-1%-1/16W-AEC-Q200; Manufacturer Name: YAGEO; Tolerance: 1%; Power: 63mW; Voltage Rating: 50V; Design Item ID: CMP-009-00210-1; Case/Package: 0402; Source: Components - 11.02.26 - 17.27.SchLib; Mounting Technology: Surface Mount; Min Operating Temperature: -55°C; Info: 0402-200k-1%-1/16W-AEC-Q200; Max Operating Temperature: 155°C; Pins: 2; Manufacturer Part Number: AC0402FR-07200KL; JLC PN: C144785
R118 R124 R132 R133 = CMP-014-000078-5: 0402-1k-1%-1/16W-AEC-Q200; Manufacturer Name: YAGEO; Voltage Rating: 50V; Power: 63mW; Tolerance: 1%; Manufacturer Part Number: AC0402FR-071KL; Pins: 2; Min Operating Temperature: -55°C; Max Operating Temperature: 155°C; Case/Package: 0402; Pin Count: 2; Source: Components - 11.02.26 - 17.27.SchLib; Mounting Technology: Surface Mount; Design Item ID: CMP-009-00192-1; Info: 0402-1k-1%-1/16W-AEC-Q200; Component Type: Standard; JLC PN: C144789
R119 R120 = CMP-014-000083-5: 0402-5.1k-1%-1/16W-AEC-Q200; Manufacturer Name: YAGEO; Tolerance: 1%; Voltage Rating: 50V; Power: 63mW; Source: Components - 11.02.26 - 17.27.SchLib; Max Operating Temperature: 155°C; Pins: 2; Manufacturer Part Number: AC0402FR-075K1L; Info: 0402-5.1k-1%-1/16W-AEC-Q200; Pin Count: 2; Mounting Technology: Surface Mount; Case/Package: 0402; Design Item ID: CMP-009-00197-1; Min Operating Temperature: -55°C; Component Type: Standard; JLC PN: C144745
R121 = CMP-014-000118-4: 0402-12k-1%-1/16W-AEC-Q200; Manufacturer Name: YAGEO; Voltage Rating: 50V; Power: 63mW; Tolerance: 1%; Source: Components - 11.02.26 - 17.27.SchLib; Info: 0402-12k-1%-1/16W-AEC-Q200; Min Operating Temperature: -55°C; Case/Package: 0402; Design Item ID: CMP-009-00210-1; Mounting Technology: Surface Mount; Pins: 2; Manufacturer Part Number: AC0402FR-0712KL; Max Operating Temperature: 155°C; JLC PN: C144798
R122 R123 = CMP-014-000120-4: 0402-27-1%-1/16W-AEC-Q200; Manufacturer Name: YAGEO; Tolerance: 1%; Voltage Rating: 50V; Power: 63mW; Mounting Technology: Surface Mount; Info: 0402-27-1%-1/16W-AEC-Q200; Pins: 2; Source: Components - 11.02.26 - 17.27.SchLib; Max Operating Temperature: 155°C; Manufacturer Part Number: AC0402FR-0727RL; Design Item ID: CMP-009-00210-1; Min Operating Temperature: -55°C; Case/Package: 0402; JLC PN: C226392
R125-R127 = CMP-014-000119-4: 0402-750-1%-1/16W-AEC-Q200; Manufacturer Name: YAGEO; Voltage Rating: 50V; Tolerance: 1%; Power: 63mW; Min Operating Temperature: -55°C; Pins: 2; Design Item ID: CMP-009-00210-1; Case/Package: 0402; Mounting Technology: Surface Mount; Source: Components - 11.02.26 - 17.27.SchLib; Info: 0402-750-1%-1/16W-AEC-Q200; Manufacturer Part Number: AC0402FR-07750RL; Max Operating Temperature: 155°C; JLC PN: C227221
R138 R139 = CMP-014-000108-4: 0402-100-1%-1/16W-AEC-Q200; Manufacturer Name: YAGEO; Voltage Rating: 50V; Power: 63mW; Tolerance: 1%; Case/Package: 0402; Manufacturer Part Number: AC0402FR-07100RL; Mounting Technology: Surface Mount; Pin Count: 2; Component Type: Standard; Max Operating Temperature: 155°C; Pins: 2; Design Item ID: CMP-009-00202-1; Min Operating Temperature: -55°C; Source: Components - 11.02.26 - 17.27.SchLib; Info: 0402-100-1%-1/16W-AEC-Q200; JLC PN: C144808
R140 R141 = CMP-014-000111-3: 0603-0-1A-AECQ200; Manufacturer Name: YAGEO; Voltage Rating: 75V; Tolerance: 1%; Mounting Technology: Surface Mount; JLC PN: C116699; Info: 0603-0-1A-AECQ200; Manufacturer Part Number: AC0603FR-070RL; Min Operating Temperature: -55°C; Max Operating Temperature: 155°C; Case/Package: 0603
SW6 = CMP-015-000062-1: Switch Tactile N.O. SPST Round Button Gull Wing 0.05A 12VDC 1.5N SMD Embossed T/R; Manufacturer Name: Omron; Contact Resistance: 100mΩ; Switch Function: Off-Mom; Max Current Rating: 50mA; Voltage Rating (DC): 12V; Manufacturer Part Number: B3U-1000P-B; Switch Type: SPST; Max Operating Temperature: 70°C; Mounting Technology: Surface Mount; JLC PN: C231329; Min Operating Temperature: -25°C
SW10 = CMP-051-000044-4: Dual 1.27mm SMT DIP Switch; Manufacturer Name: hanxia; JLC PN: C7430304; Manufacturer Part Number: HX 1.27-2PBJ TPPT
U13 = CMP-051-000048-2: Microwire Serial EEPROM Family, 2.5Vto 5.5V' 2 MHz, -40°Cto 125°C, SOT-23-6, RoHS; Manufacturer Name: Microchip; Max Supply Voltage: 5.5V; Interface: SPI; Min Supply Voltage: 2.5V; Memory Size: 256B; Height: 1.45mm; Min Operating Temperature: -40°C; Max Operating Temperature: 85°C; Case/Package: SOT-23; Memory Format: EEPROM; JLC PN: C190271; Mounting Technology: Surface Mount; Pins: 6; Manufacturer Part Number: 93LC56BT-I/OT
U21 U26 = CMP-051-000053-3: LSF0108 - 8-bit bidirectional multi-voltage level translator; open-drain; push-pull; Manufacturer Name: Nexperia; Operating Supply Current: 128mA; Number of Channels: 8; Min Supply Voltage: 950mV; Data Rate: 200Mbps; Max Supply Voltage: 5V; Topology: Open-Drain, Push-Pull; Pins: 20; Logic Function: Translator; Max Operating Temperature: 125°C; Min Operating Temperature: -40°C; Mounting Technology: Surface Mount; Channel Type: Bidirectional; JLC PN: C551522; Case/Package: TSSOP; Height: 1.1mm; Manufacturer Part Number: LSF0108PWJ
U22 = CMP-051-000002-4: USB Hi-Speed to Dual Channel Serial UART/FIFO/JTAG/SPI/I2C IC - LQFP-64; Manufacturer Name: FTDI; Operating Supply Current: 70mA; Data Rate: 60Mbps; Pin Count: 64; Source: FT2232HL-REEL.SchLib; Design Item ID: FT2232HL-REEL; Min Operating Temperature: -40°C; JLC PN: C27882; Case/Package: LQFP-64; Max Operating Temperature: 85°C; Manufacturer Part Number: FT2232HL-REEL
U23 = CMP-051-000052-2: Configurable Multiple-Function Gate 6-SOT-5X3 -40 to 125; Manufacturer Name: Texas Instruments; Logic Function: Multi Function; Max Supply Voltage: 5.5V; Min Supply Voltage: 1.65V; Number of Outputs: 1; Number of Inputs: 3; JLC PN: C2859828; Height: 600µm; Pins: 6; Mounting Technology: Surface Mount; Max Operating Temperature: 125°C; Min Operating Temperature: -40°C; Manufacturer Part Number: SN74LVC1G58DRLR
U24 = CMP-051-000050-3: NOR Flash Serial (SPI, Dual SPI, Quad SPI) 2.5V/3V/3.3V 128M-bit 16M x 8 8ns 8-Pin SOIC T/R; Manufacturer Name: ISSI; Min Supply Voltage: 2.3V; Max Supply Voltage: 3.6V; Type: Type; Pins: 8; Min Operating Temperature: -40°C; RefDes: RefDes; Case/Package: SOIC; Memory Format: FLASH; JLC PN: C521290; Copyright: Copyright (C) 2025 Ultra Librarian. All rights reserved.; Max Operating Temperature: 105°C; Design Item ID: IS25LP128-JBLE-TR; Source: IS25LP128-JBLE-TR.SchLib; Manufacturer Part Number: IS25LP128-JBLE-TR
X3 = CMP-005-000017-2: Ceramic Resonator 12MHz ±0.5% (Tol) ±0.2% (Stability) 33pF 30Ohm 3-Pin CSMD T/R; Manufacturer Name: Murata Electronics; ESR (Equivalent Series Resistance): 30Ω; Frequency Stability: 2000ppm; Mounting Technology: Surface Mount; Frequency: 12MHz; Load Capacitance: 33pF; Manufacturer Part Number: CSTNE12M0G550000R0; JLC PN: C341520; Max Operating Temperature: 85°C; Design Item ID: CSTNE12M0G550000R0; Frequency Tolerance: 0.5%; Min Operating Temperature: -40°C; Source: CSTNE12M0G550000R0.SchLib

## Sheet Breakout_FPGA.SchDoc
size B; DocumentNumber: 6; SheetNumber: 6; SheetTotal: 8
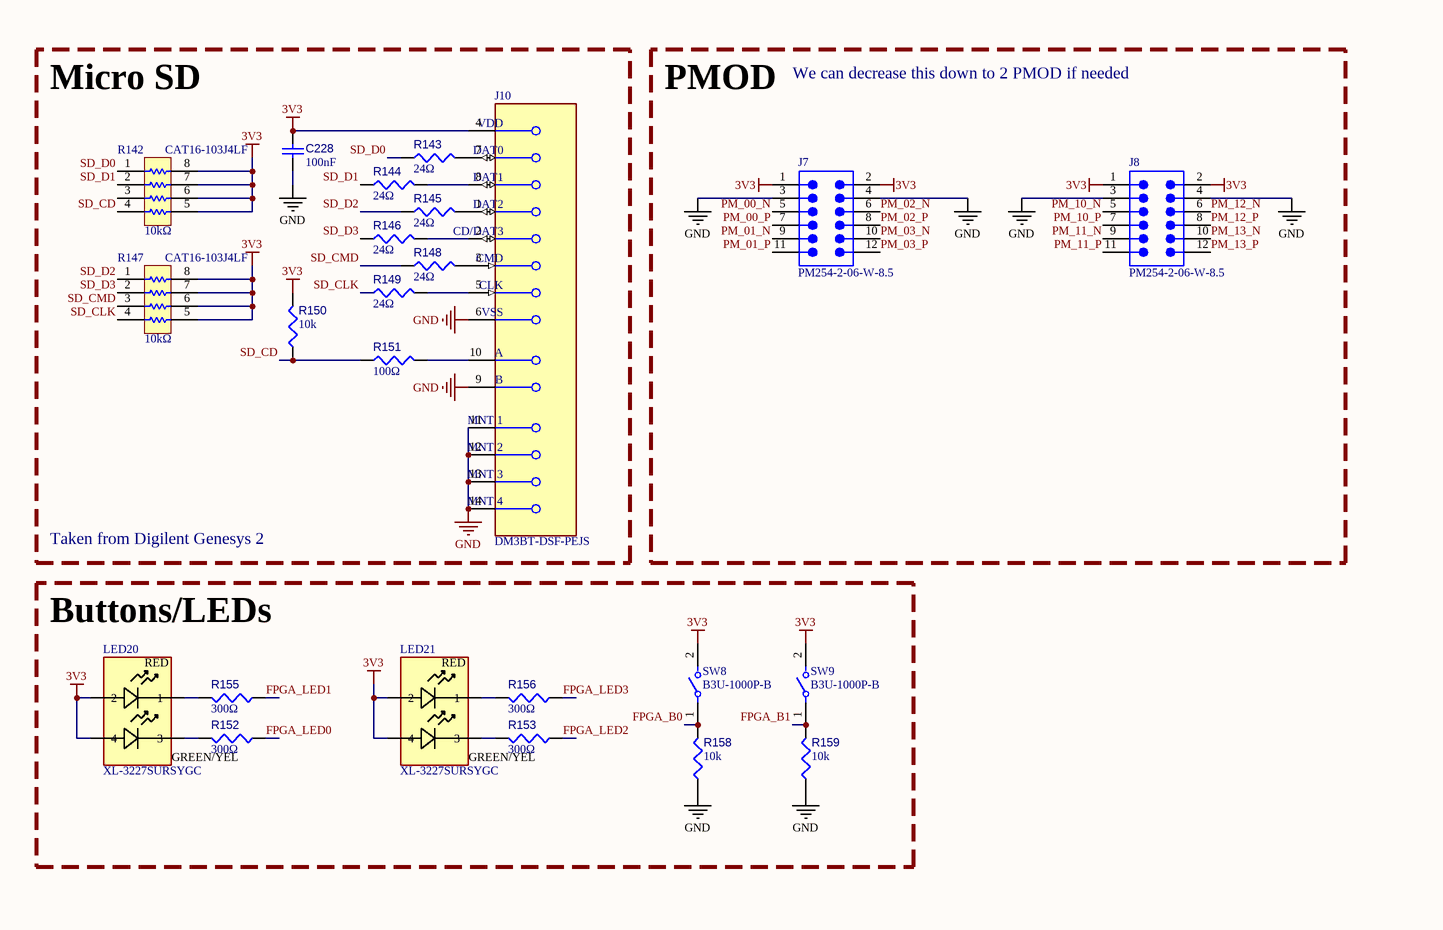
[diagram p10: Breakout_FPGA.SchDoc, left]
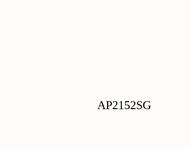
[diagram p11: Breakout_FPGA.SchDoc, right]

### Parts
C228  value 100nF  [CAP-0402-MFG]  (hidden comment: CL05B104KA54PNC)
J7  PM254-2-06-W-8.5  [2x6-RA-FEM-2.54mm-CONN]
J8  PM254-2-06-W-8.5  [2x6-RA-FEM-2.54mm-CONN]
J10  DM3BT-DSF-PEJS  [MICROSD-10(8+2)-MFG]
LED20  XL-3227SURSYGC  [LED-1210-4P-MFG]
LED21  XL-3227SURSYGC  [LED-1210-4P-MFG]
R142  CAT16-103J4LF  value 10kΩ  [RES-4x0603-MFG]
R143  value 24Ω  [RES-0402]  (hidden comment: AC0402FR-0724RL)
R144  value 24Ω  [RES-0402]  (hidden comment: AC0402FR-0724RL)
R145  value 24Ω  [RES-0402]  (hidden comment: AC0402FR-0724RL)
R146  value 24Ω  [RES-0402]  (hidden comment: AC0402FR-0724RL)
R147  CAT16-103J4LF  value 10kΩ  [RES-4x0603-MFG]
R148  value 24Ω  [RES-0402]  (hidden comment: AC0402FR-0724RL)
R149  value 24Ω  [RES-0402]  (hidden comment: AC0402FR-0724RL)
R150  value 10k  [RES-0402]  (hidden comment: AC0402FR-0710KL)
R151  value 100Ω  [RES-0402]  (hidden comment: AC0402FR-07100RL)
R152  value 300Ω  [RES-0402]  (hidden comment: AC0402FR-07300RL)
R153  value 300Ω  [RES-0402]  (hidden comment: AC0402FR-07300RL)
R155  value 300Ω  [RES-0402]  (hidden comment: AC0402FR-07300RL)
R156  value 300Ω  [RES-0402]  (hidden comment: AC0402FR-07300RL)
R158  value 10k  [RES-0402]  (hidden comment: AC0402FR-0710KL)
R159  value 10k  [RES-0402]  (hidden comment: AC0402FR-0710KL)
SW8  B3U-1000P-B  [FP-B3U-1000P-B-MFG]
SW9  B3U-1000P-B  [FP-B3U-1000P-B-MFG]

### Blocks framed on the sheet
Micro SD: C228 J10 R142-R151
PMOD: J7 J8
Buttons/LEDs: LED20 LED21 R152 R153 R155 R156 R158 R159 SW8 SW9

### Nets
3V3: C228.1 J7.1 J7.2 J8.1 J8.2 J10.4(VDD) LED20.2 LED20.4 LED21.2 LED21.4 R142.5 R142.6 R142.7 R142.8 R147.5 R147.6 R147.7 R147.8 R150.2 SW8.2 SW9.2
GND: C228.2 J7.3 J7.4 J8.3 J8.4 J10.6(VSS) J10.9(B) J10.11(MNT_1) J10.12(MNT_2) J10.13(MNT_3) J10.14(MNT_4) R158.1 R159.1
FPGA_B0: R158.2 SW8.1
FPGA_B1: R159.2 SW9.1
FPGA_LED0: R152.2
FPGA_LED1: R155.2
FPGA_LED2: R153.2
FPGA_LED3: R156.2
PM_00_N: J7.5
PM_00_P: J7.7
PM_01_N: J7.9
PM_01_P: J7.11
PM_02_N: J7.6
PM_02_P: J7.8
PM_03_N: J7.10
PM_03_P: J7.12
PM_10_N: J8.5
PM_10_P: J8.7
PM_11_N: J8.9
PM_11_P: J8.11
PM_12_N: J8.6
PM_12_P: J8.8
PM_13_N: J8.10
PM_13_P: J8.12
SD_CD: R142.4 R150.1 R151.1
SD_CLK: R147.4 R149.1
SD_CMD: R147.3 R148.1
SD_D0: R142.1 R143.1
SD_D1: R142.2 R144.1
SD_D2: R145.1 R147.1
SD_D3: R146.1 R147.2
NetJ10_1: J10.1(DAT2) R145.2
NetJ10_2: J10.2(CD/DAT3) R146.2
NetJ10_3: J10.3(CMD) R148.2
NetJ10_5: J10.5(CLK) R149.2
NetJ10_7: J10.7(DAT0) R143.2
NetJ10_8: J10.8(DAT1) R144.2
NetJ10_10: J10.10(A) R151.2
NetLED20_1: LED20.1 R155.1
NetLED20_3: LED20.3 R152.1
NetLED21_1: LED21.1 R156.1
NetLED21_3: LED21.3 R153.1

Not connected (* = marked no-connect by the designer): R142 3

### Notes on the sheet
- We can decrease this down to 2 PMOD if needed
- Taken from Digilent Genesys 2
- AP2152SG
- (in symbol CMP-132-000003-3) RED; GREEN/YEL

### Library data of the parts
C228 = CMP-104-000104-6: 0402-100n-10%-25V-X7R-AECQ200; Manufacturer Name: Samsung; Capacitor Type: Ceramic; Voltage Rating: 25V; Tolerance: 10%; Temp Code: X7R; Min Operating Temperature: -55°C; Component Type: Standard; Max Operating Temperature: 125°C; Case/Package: 0402; Info: 0402-100n-10%-25V-X7R-AECQ200; Pins: 2; Pin Count: 2; Mounting Technology: Surface Mount; Manufacturer Part Number: CL05B104KA54PNC; Design Item ID: CMP-001-00131-1; Source: Components - 11.02.26 - 17.26.SchLib; JLC PN: C346180
J7 J8 = CMP-055-000216-1: Pin Header, Board-to-Board, 2.54 mm, 2 Rows, 12 Contacts, Through Hole, TSW Series; Manufacturer Name: HCTL; Pitch: 2.54mm; Gender: Female; Max Current Rating: 7.6A; Connector Type: Male Pin; Number of Positions: 12; Mounting Technology: Through Hole; Max Operating Temperature: 105°C; JLC PN: C2897426; Termination: Solder; Number of Rows: 2; Min Operating Temperature: -40°C; Manufacturer Part Number: PM254-2-06-W-8.5
J10 = CMP-055-000213-2: Memory Card Connector, MicroSD, Push-Push, 8 Contacts, Copper Alloy, Gold Plated Contacts, DM3; Manufacturer Name: Hirose; Connector Type: Connector, Socket; Gender: Female; Max Current Rating: 500mA; Contact Pitch: 1.1mm; Min Operating Temperature: -25°C; Contact Plating: Gold; Max Operating Temperature: 85°C; Mounting Technology: Surface Mount; JLC PN: C597972; Pins: 8; Manufacturer Part Number: DM3BT-DSF-PEJS
LED20 LED21 = CMP-132-000003-3: LED indicator light dual color red yellow green 1210 front facing; Manufacturer Name: XINLIGHT; Manufacturer Part Number: XL-3227SURSYGC; JLC PN: C965843
R142 R147 = CMP-014-000100-1: Res Thick Film Array 10K Ohm 5% 0.25W(1/4W) ±200ppm/C ISOL 8-Pin 1206(4 X 0603) Concave SMD T/R; Manufacturer Name: Bourns; Number of Resistors: 4; Voltage Rating (DC): 50V; Power Dissipation: 250mW; Mounting Technology: Surface Mount; Tolerance: 5%; Manufacturer Part Number: CAT16-103J4LF; Min Operating Temperature: -55°C; JLC PN: C840650; Case/Package: 0603x4; Max Operating Temperature: 125°C; Pins: 8
R143-R146 R148 R149 = CMP-014-000123-4: 0402-24-1%-1/16W-AEC-Q200; Manufacturer Name: YAGEO; Tolerance: 1%; Voltage Rating: 50V; Power: 63mW; Case/Package: 0402; Mounting Technology: Surface Mount; Manufacturer Part Number: AC0402FR-0724RL; Design Item ID: CMP-009-00210-1; Pins: 2; Min Operating Temperature: -55°C; Info: 0402-24-1%-1/16W-AEC-Q200; Source: Components - 11.02.26 - 17.27.SchLib; Max Operating Temperature: 155°C; JLC PN: C226373
R150 R158 R159 = CMP-014-000077-5: as R56 on sheet SoC; Pins: 2; Source: Components - 11.02.26 - 17.27.SchLib; Manufacturer Part Number: AC0402FR-0710KL; Info: 0402-10k-1%-1/16W-AEC-Q200; Min Operating Temperature: -55°C; Pin Count: 2; Case/Package: 0402; Design Item ID: CMP-009-00191-3; Max Operating Temperature: 155°C; Component Type: Standard; Mounting Technology: Surface Mount; JLC PN: C144807
R151 = CMP-014-000108-4: as R138 on sheet SoC; Case/Package: 0402; Manufacturer Part Number: AC0402FR-07100RL; Mounting Technology: Surface Mount; Pin Count: 2; Component Type: Standard; Max Operating Temperature: 155°C; Pins: 2; Design Item ID: CMP-009-00202-1; Min Operating Temperature: -55°C; Source: Components - 11.02.26 - 17.27.SchLib; Info: 0402-100-1%-1/16W-AEC-Q200; JLC PN: C144808
R152 R153 R155 R156 = CMP-014-000122-4: 0402-300-1%-1/16W-AEC-Q200; Manufacturer Name: YAGEO; Voltage Rating: 50V; Power: 63mW; Tolerance: 1%; Case/Package: 0402; Info: 0402-300-1%-1/16W-AEC-Q200; Pins: 2; Source: Components - 11.02.26 - 17.27.SchLib; Manufacturer Part Number: AC0402FR-07300RL; Max Operating Temperature: 155°C; Mounting Technology: Surface Mount; Design Item ID: CMP-009-00210-1; Min Operating Temperature: -55°C; JLC PN: C144768
SW8 SW9 = CMP-015-000062-1: as SW6 on sheet SoC; Manufacturer Part Number: B3U-1000P-B; Switch Type: SPST; Max Operating Temperature: 70°C; Mounting Technology: Surface Mount; JLC PN: C231329; Min Operating Temperature: -25°C